# Altium schematic sheet 直流电机调速原理.SchDoc
size A4
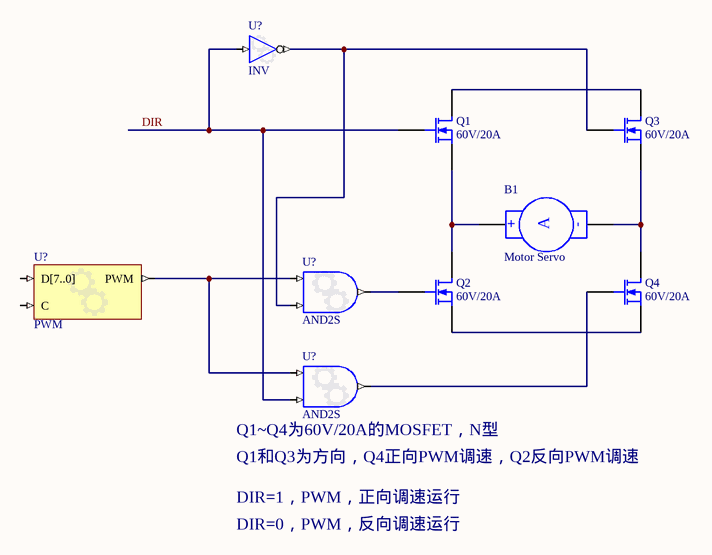
[diagram p0: 直流电机调速原理.SchDoc]

## Parts
(Parts that share a designator on the sheet are numbered #1, #2 ... from top to bottom, then left to right.)
B1  Motor Servo  [RAD-0.4]
Q1  60V/20A  [BCY-W3/B.8]
Q2  60V/20A  [BCY-W3/B.8]
Q3  60V/20A  [BCY-W3/B.8]
Q4  60V/20A  [BCY-W3/B.8]
U?#1  INV
U?#2  PWM
U?#3  AND2S
U?#4  AND2S

## Nets
DIR: Q1.2(G) U?#1.I U?#4.I1
NetB1_1: B1.1(+) Q1.3(S) Q2.1(D)
NetB1_2: B1.2(-) Q3.3(S) Q4.1(D)
NetQ1_1: Q1.1(D) Q3.1(D)
NetQ2_2: Q2.2(G) U?#3.O
NetQ2_3: Q2.3(S) Q4.3(S)
NetQ3_2: Q3.2(G) U?#1.O U?#3.I1
NetQ4_2: Q4.2(G) U?#4.O
NetU?#2_PWM: U?#2.PWM U?#3.I0 U?#4.I0

Not connected (* = marked no-connect by the designer): U?#2 C D[7..0]

## Notes on the sheet
- (near U?#4) Q1~Q4为60V/20A的MOSFET，N型
- (near U?#4) Q1和Q3为方向，Q4正向PWM调速，Q2反向PWM调速
- DIR=1，PWM，正向调速运行
- DIR=0，PWM，反向调速运行
- (in symbol Motor Servo) A

## Library data of the parts
B1 = Motor Servo: Servo Motor; Published: 24-Mar-1999; LatestRevisionDate: 17-Jul-2002; LatestRevisionNote: Re-released for DXP Platform.; PackageReference: RAD-0.4; Publisher: Altium Limited
Q1-Q4 = MOSFET-N: N-Channel MOSFET; Published: 8-Jun-2000; LatestRevisionDate: 17-Jul-2002; LatestRevisionNote: Re-released for DXP Platform.; PackageVersion: 1995/1996; PackageReference: E3; Publisher: Altium Limited
U?#1 = INV: Configurable Inverter; ConfigurationParameters: {}Version[1.1]{}SignalCount[1]{}SignalWidth0[1]{}OutputOption0[Inverted]{}EnableMode[None]{}ShowPinNames[False]{}; ConfiguratorName: GENERIC_BUFFER; LastRevisionNo: 1.00.00; Published: 10-Oct-2008; Publisher: Altium Limited; HelpURL: https://wiki.altium.com/display/ADOH/Configurable+Generic+Library
U?#2 = PWM: Configurable PWM; ConfiguratorName: GENERIC_PWM; ConfigurationParameters: {}Version[1.0]{}Width[8]{}Prescaler[1]{}; LastRevisionNo: 1.00.00; Published: 8-Apr-2009; Publisher: Altium Limited; HelpURL: https://wiki.altium.com/display/ADOH/New+Configurable+Generic+FPGA+Logic+Components
U?#3 U?#4 = GATE: Configurable Generic Gate; ConfiguratorName: GENERIC_GATE; ConfigurationParameters: {}Version[1.1]{}GateKind[AND]{}BusInput[False]{}GateInputType[Bit]{}GateOutputOption[Normal]{}BusWidth[8]{}RegisterOutputs[False]{}NegativeClockEdge[False]{}InputCount[2]{}InputInvert0[False]{}InputInvert1[False]{}; LastRevisionNo: 1.00.00; Published: 3-Sep-2008; Publisher: Altium Limited; HelpURL: https://wiki.altium.com/display/ADOH/Configurable+Generic+Library